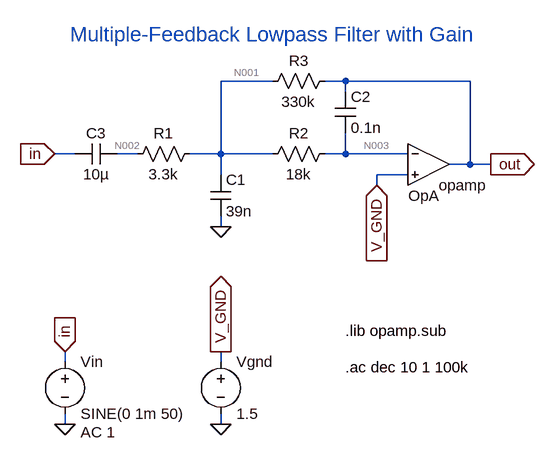
[diagram p0: schematic MF_lowpass.asc]
MF_lowpass.asc, the LTspice schematic file:
Version 4
SHEET 1 880 680
WIRE 192 -208 112 -208
WIRE 304 -208 272 -208
WIRE 496 -208 304 -208
WIRE 304 -192 304 -208
WIRE -112 -96 -144 -96
WIRE -16 -96 -48 -96
WIRE 112 -96 112 -208
WIRE 112 -96 64 -96
WIRE 192 -96 112 -96
WIRE 304 -96 304 -128
WIRE 304 -96 272 -96
WIRE 400 -96 304 -96
WIRE 496 -80 496 -208
WIRE 496 -80 464 -80
WIRE 528 -80 496 -80
WIRE 112 -64 112 -96
WIRE 400 -64 352 -64
WIRE 352 -48 352 -64
WIRE 112 16 112 0
WIRE -128 224 -128 208
WIRE 112 224 112 208
WIRE -128 320 -128 304
WIRE 112 320 112 304
FLAG -128 320 0
FLAG -128 208 in
IOPIN -128 208 In
FLAG 352 -48 V_GND
IOPIN 352 -48 In
FLAG -144 -96 in
IOPIN -144 -96 In
FLAG 528 -80 out
IOPIN 528 -80 Out
FLAG 112 320 0
FLAG 112 208 V_GND
IOPIN 112 208 Out
FLAG 112 16 0
SYMBOL OpAmps\\opamp 432 -144 R0
WINDOW 0 -31 112 Left 2
SYMATTR InstName OpA
SYMBOL voltage -128 208 R0
WINDOW 123 24 124 Left 2
WINDOW 39 0 0 Left 0
SYMATTR Value2 AC 1
SYMATTR InstName Vin
SYMATTR Value SINE(0 1m 50)
SYMBOL cap -48 -112 R90
WINDOW 0 0 32 VBottom 2
WINDOW 3 32 32 VTop 2
SYMATTR InstName C3
SYMATTR Value 10µ
SYMBOL voltage 112 208 R0
WINDOW 123 24 124 Left 2
WINDOW 39 0 0 Left 0
SYMATTR InstName Vgnd
SYMATTR Value 1.5
SYMBOL cap 288 -192 R0
SYMATTR InstName C2
SYMATTR Value 0.1n
SYMBOL cap 96 -64 R0
SYMATTR InstName C1
SYMATTR Value 39n
SYMBOL res 80 -112 R90
WINDOW 0 0 56 VBottom 2
WINDOW 3 32 56 VTop 2
SYMATTR InstName R1
SYMATTR Value 3.3k
SYMBOL res 288 -112 R90
WINDOW 0 0 56 VBottom 2
WINDOW 3 32 56 VTop 2
SYMATTR InstName R2
SYMATTR Value 18k
SYMBOL res 288 -224 R90
WINDOW 0 0 56 VBottom 2
WINDOW 3 32 56 VTop 2
SYMATTR InstName R3
SYMATTR Value 330k
TEXT 304 176 Left 2 !.lib opamp.sub
TEXT 304 232 Left 2 !.ac dec 10 1 100k
TEXT -120 -280 Left 3 ;Multiple-Feedback Lowpass Filter with Gain

The netlist it stands for:
* MF_lowpass.asc
XOpA N003 V_GND out opamp Aol=100K GBW=10Meg  ; pins invin noninvin out
Vin in 0 SINE(0 1m 50) AC 1
C3 N002 in 10µ
Vgnd V_GND 0 1.5
C2 out N003 0.1n
C1 N001 0 39n
R1 N001 N002 3.3k
R2 N003 N001 18k
R3 out N001 330k
.lib opamp.sub
.ac dec 10 1 100k
* Multiple-Feedback Lowpass Filter with Gain
.backanno
.end

* Results of the author's LTspice run, read from the files saved beside the schematic
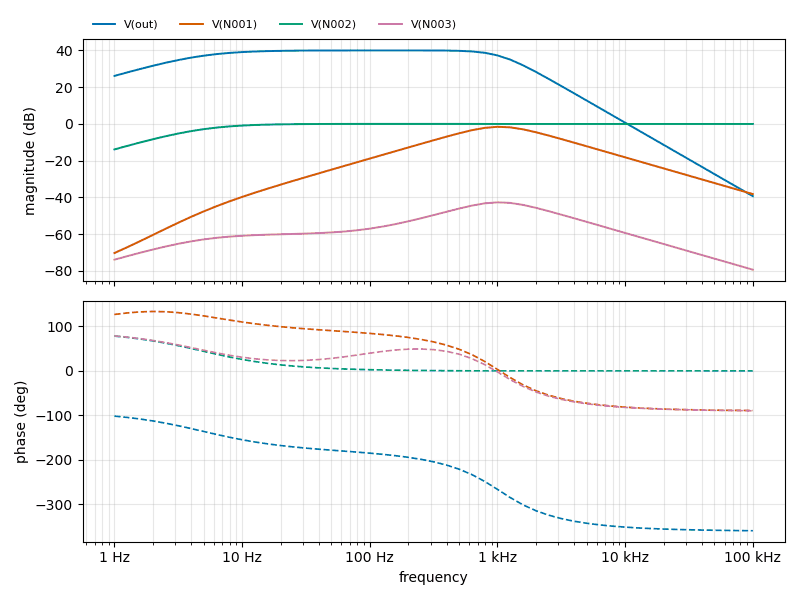
[diagram p1: AC Analysis of MF_lowpass.asc, plotted from the saved traces]
* AC Analysis, 1 run:
*   V(out): 26.15 dB at 1 Hz, -39.30 dB at 100 kHz, peak 40.03 dB at 158.5 Hz, 3 dB below the peak at 4.851 Hz and 1.03 kHz
*   V(N001): -70.23 dB at 1 Hz, -38.16 dB at 100 kHz, peak -1.54 dB at 1 kHz, 3 dB below the peak at 537.6 Hz and 2.013 kHz
*   V(N002): -13.84 dB at 1 Hz, -0.00 dB at 100 kHz, peak 0.04 dB at 199.5 Hz, 3 dB below the peak at 4.855 Hz
*   V(N003): -73.85 dB at 1 Hz, -79.30 dB at 100 kHz, peak -42.64 dB at 1 kHz, 3 dB below the peak at 529.4 Hz and 2.005 kHz